# Altium schematic sheet protect circuit.SchDoc
size A4; SheetNumber: 2; SheetTotal: 2
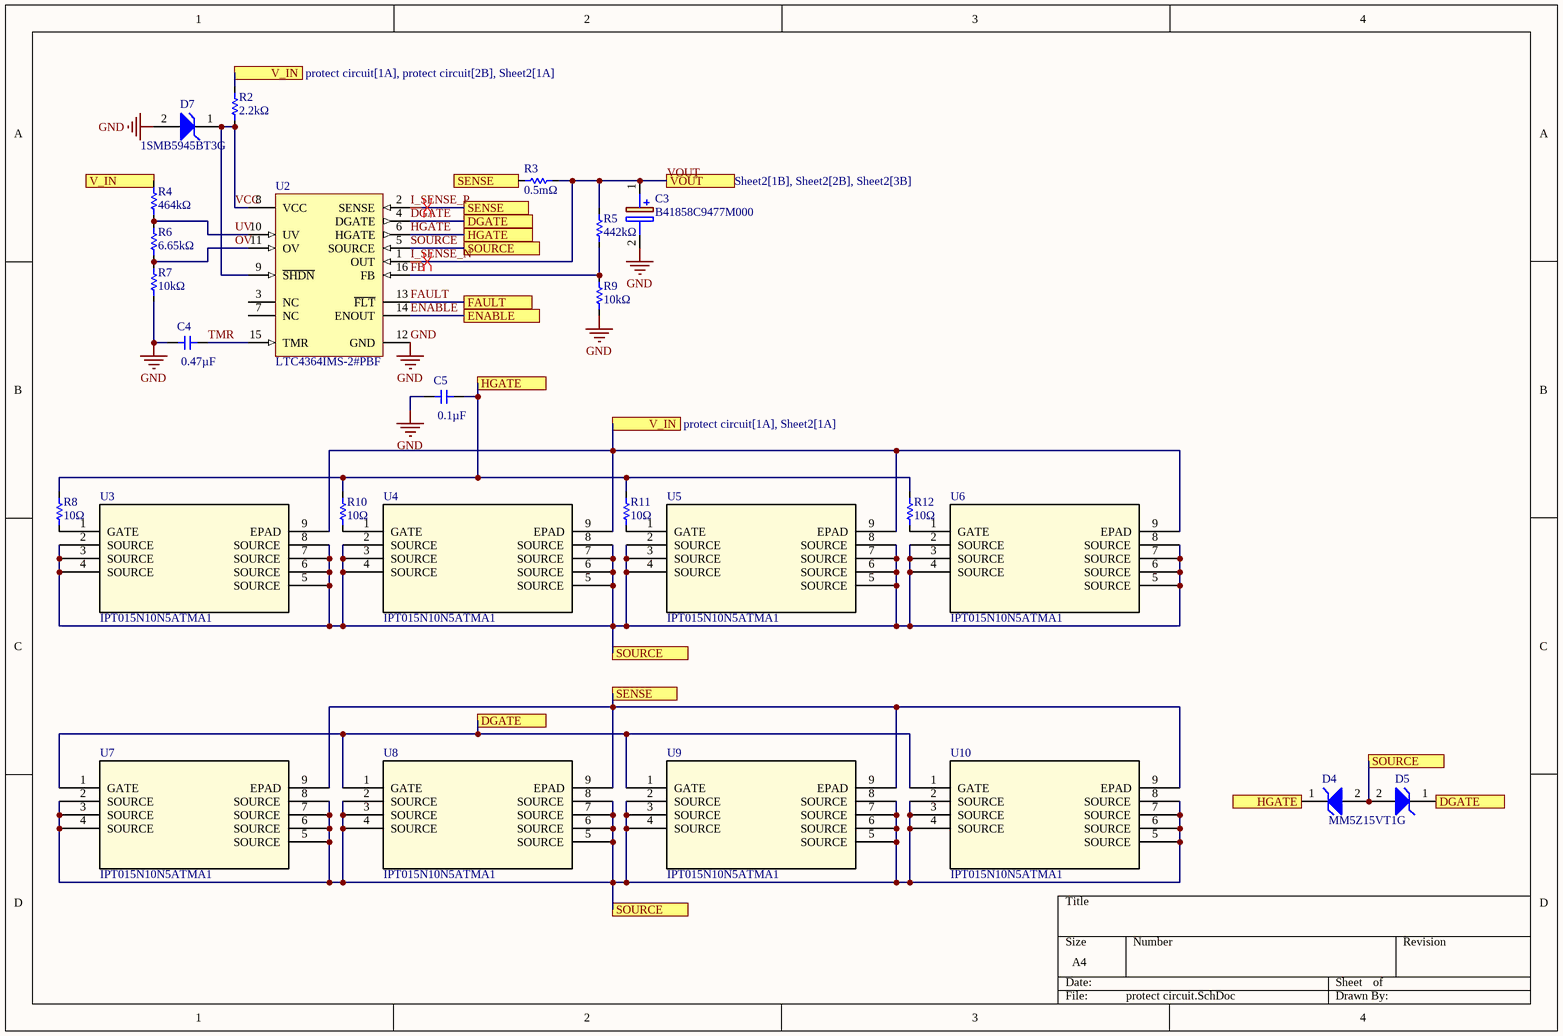
[diagram p0: protect circuit.SchDoc]

## Parts
C3  B41858C9477M000  [CAPPRD750W90D1800H3700]
C4  Capacitance: 0.47µF  [1210]  (hidden comment: non-polar_Capacitor)
C5  Capacitance: 0.1µF  [1210]  (hidden comment: non-polar_Capacitor)
D4  MM5Z15VT1G  [ONSC-SOD-523-2-502-01_V]
D5  MM5Z15VT1G  [ONSC-SOD-523-2-502-01_V]  (value not drawn)
D7  1SMB5945BT3G  [ONSC-SMB-2-403A-03_H_V]
R2  2.2kΩ  [SMD_2512]
R3  0.5mΩ  [SMD_2512]
R4  464kΩ  [SMD_0603]
R5  442kΩ  [SMD_0603]
R6  6.65kΩ  [SMD_0603]
R7  10kΩ  [SMD_0603]
R8  10Ω  [SMD_0603]
R9  10kΩ  [SMD_0603]
R10  10Ω  [SMD_0603]
R11  10Ω  [SMD_0603]
R12  10Ω  [SMD_0603]
U2  LTC4364IMS-2#PBF  [LT-MS-16_M]
U3  IPT015N10N5ATMA1  [PG-HSOF-8-1_INF]
U4  IPT015N10N5ATMA1  [PG-HSOF-8-1_INF]
U5  IPT015N10N5ATMA1  [PG-HSOF-8-1_INF]
U6  IPT015N10N5ATMA1  [PG-HSOF-8-1_INF]
U7  IPT015N10N5ATMA1  [PG-HSOF-8-1_INF]
U8  IPT015N10N5ATMA1  [PG-HSOF-8-1_INF]
U9  IPT015N10N5ATMA1  [PG-HSOF-8-1_INF]
U10  IPT015N10N5ATMA1  [PG-HSOF-8-1_INF]

## Ports
DGATE (see protect circuit[2A], protect circuit[2C]), DGATE (see protect circuit[2A], protect circuit[4D]), DGATE (see protect circuit[2C], protect circuit[4D]), ENABLE, FAULT, HGATE (see protect circuit[2A], protect circuit[2B]), HGATE (see protect circuit[2A], protect circuit[4D]), HGATE (see protect circuit[2B], protect circuit[4D]), SENSE (see protect circuit[2A]), SENSE (see protect circuit[2A], protect circuit[2C]), SOURCE (see protect circuit[2A], protect circuit[2C], protect circuit[2D]), SOURCE (see protect circuit[2A], protect circuit[2C], protect circuit[4C]), SOURCE (see protect circuit[2A], protect circuit[2D], protect circuit[4C]), SOURCE (see protect circuit[2C], protect circuit[2D], protect circuit[4C]), V_IN (see protect circuit[1A], protect circuit[2B], Sheet2[1A]), V_IN (see protect circuit[1A], Sheet2[1A]), VOUT (see Sheet2[1B], Sheet2[2B], Sheet2[3B])

## Nets
GND: C3.2(-) C4.1 C5.1 D7.2(A) R7.2 R9.2 U2.12(GND)
DGATE: D5.1(K) U2.4(DGATE) U7.1(GATE) U8.1(GATE) U9.1(GATE) U10.1(GATE) ; port DGATE
ENABLE: U2.14(ENOUT) ; port ENABLE
FAULT: U2.13(~{FLT}) ; port FAULT
FB: R5.2 R9.1 U2.16(FB)
HGATE: C5.2 D4.1(K) R8.1 R10.1 R11.1 R12.1 U2.6(HGATE) ; port HGATE
I_SENSE_N: C3.1(+) R3.2 R5.1 U2.1(OUT) ; port VOUT  [also labelled VOUT]
I_SENSE_P: R3.1 U2.2(SENSE) U7.9(EPAD) U8.9(EPAD) U9.9(EPAD) U10.9(EPAD) ; port SENSE
OV: R6.2 R7.1 U2.11(OV)
SOURCE: D4.2(A) D5.2(A) U2.5(SOURCE) U3.2(SOURCE) U3.3(SOURCE) U3.4(SOURCE) U3.5(SOURCE) U3.6(SOURCE) U3.7(SOURCE) U3.8(SOURCE) U4.2(SOURCE) U4.3(SOURCE) U4.4(SOURCE) U4.5(SOURCE) U4.6(SOURCE) U4.7(SOURCE) U4.8(SOURCE) U5.2(SOURCE) U5.3(SOURCE) U5.4(SOURCE) U5.5(SOURCE) U5.6(SOURCE) U5.7(SOURCE) U5.8(SOURCE) U6.2(SOURCE) U6.3(SOURCE) U6.4(SOURCE) U6.5(SOURCE) U6.6(SOURCE) U6.7(SOURCE) U6.8(SOURCE) U7.2(SOURCE) U7.3(SOURCE) U7.4(SOURCE) U7.5(SOURCE) U7.6(SOURCE) U7.7(SOURCE) U7.8(SOURCE) U8.2(SOURCE) U8.3(SOURCE) U8.4(SOURCE) U8.5(SOURCE) U8.6(SOURCE) U8.7(SOURCE) U8.8(SOURCE) U9.2(SOURCE) U9.3(SOURCE) U9.4(SOURCE) U9.5(SOURCE) U9.6(SOURCE) U9.7(SOURCE) U9.8(SOURCE) U10.2(SOURCE) U10.3(SOURCE) U10.4(SOURCE) U10.5(SOURCE) U10.6(SOURCE) U10.7(SOURCE) U10.8(SOURCE) ; port SOURCE
TMR: C4.2 U2.15(TMR)
UV: R4.2 R6.1 U2.10(UV)
V_IN: R2.1 R4.1 U3.9(EPAD) U4.9(EPAD) U5.9(EPAD) U6.9(EPAD) ; port V_IN
VCC: D7.1(K) R2.2 U2.8(VCC) U2.9(~{SHDN})
NetR8_2: R8.2 U3.1(GATE)
NetR10_2: R10.2 U4.1(GATE)
NetR11_2: R11.2 U5.1(GATE)
NetR12_2: R12.2 U6.1(GATE)

Not connected (* = marked no-connect by the designer): U2 3(NC) 7(NC)

## Layout directives
differential pair: I_SENSE_N, I_SENSE_P

## Library data of the parts
C3 = B41858C9477M000: Capacitor Polarised; Manufacturer_Name: TDK; Datasheet Link: https://product.tdk.com/system/files/dam/doc/product/capacitor/aluminum-electrolytic/single-ended/data_sheet/20/30/db/aec/b41858.pdf; Height: 37mm; Manufacturer_Part_Number: B41858C9477M000; Mouser Part Number: 871-B41858C9477M; Mouser Price/Stock: https://www.mouser.co.uk/ProductDetail/EPCOS-TDK/B41858C9477M000?qs=nadT%2FcWsIvCTpIhXZMST%2FQ%3D%3D
C4 C5 = CMP-024-000020-15: SMD type ceramic capacitor; Voltage: 50V; Design Item ID: Capacitor; Source: robit_passive.SchLib
D4 D5 = CMP-1060-00793-1: Zener Voltage Regulator, 500 mW, 2-Pin SOD-523, Pb-Free, Tape and Reel; Manufacturer: On Semiconductor; VZ Typ (V): 15; P Max (W): 0.5; PackageVersion: Rev. E, 09/2010; PartNumber: MM5Z15VT1G; ComponentLink2URL: http://www.onsemi.cn/pub_link/Collateral/MM5Z2V4T1-D.PDF; ComponentLink2Description: Datasheet; ComponentLink1Description: Manufacturer URL; PackageReference: SOD-523-2-502-01; ComponentLink3URL: http://www.onsemi.com/pub_link/Collateral/502-01.PDF; PackageDescription: 2-Pin SOD, Body 1.2 x 0.8 mm; ComponentLink3Description: Package Specification; RoHS: Pb-Free; ComponentLink1URL: http://www.onsemi.com/; Mounting Technology: Surface Mount; Packing: Tape and Reel; DatasheetVersion: Rev. 10
D7 = CMP-1060-00175-1: 3 W Zener Voltage Regulator, 2-Pin SMB, Pb-Free, Tape and Reel; Manufacturer: On Semiconductor; VZ Typ (V): 68; ComponentLink3URL: http://www.onsemi.com/pub_link/Collateral/1SMB5913BT3-D.PDF; PackageReference: SMB-2-403A-03_H; PackageDescription: 2-Pin Small Molded Package, J-Bend Lead, Body 4.33 x 3.625 mm; PackageVersion: Rev. H, 05/2011; PartNumber: 1SMB5945BT3G; DatasheetVersion: Rev. 8; ComponentLink1Description: Manufacturer URL; ComponentLink1URL: http://www.onsemi.com/; RoHS: Pb-Free; ComponentLink2Description: Datasheet; Packing: Tape and Reel; ComponentLink2URL: http://www.onsemi.com/pub_link/Collateral/1SMB5913BT3-D.PDF; ComponentLink3Description: Package Specification; Mounting Technology: Surface Mount
R2-R12 = Resistor
U2 = CMP-0474-00539-1: Surge Stopper with Ideal Diode, 4 to 80 V Vin, 16-pin SOP (MS-16), -40 to 85 degC, Pb-Free; Manufacturer: Linear Technology; Fast Comparator: no; Circuit Breaker Threshold: 50 mV; Circuit Breakers(#): 1; Active Limiting: yes; Vin Range: 4 to 80 V; Circuit Breaker Accuracy(%): 10; Extended Temp: C, I, H; ComponentLink1Description: Manufacturer URL; PackageReference: MS16; Mounting Technology: Surface Mount; RoHS: TRUE; PackageDescription: 16-Pin Plastic MSOP, Body 4.04 x 3.00 mm, Pitch 0.50 mm; ComponentLink3Description: Package Specification; PartNumber: LTC4364IMS-2#PBF; Power Good: no; ComponentLink2Description: Datasheet; ComponentLink2URL: http://cds.linear.com/docs/en/datasheet/436412f.pdf; ComponentLink1URL: http://www.linear.com/; ComponentLink3URL: http://cds.linear.com/docs/en/packaging/05081669_A_MS16.pdf; PackageVersion: Rev. Ã˜, 06/2010
U3-U10 = IPT015N10N5ATMA1: Infineonâ€™s OptiMOSâ„¢ power MOSFET in TO-Leadless package is optimized for high current applications up to 300 A, such as forklifts, light electric vehicles (LEV), power tools, point-of-loads (POL), telecom and e-fuses. Furthermore, the 60 percent smaller package size enables a very compact design. Compared to DÂ²PAK 7-pin, TO-Leadless shows a substantial reduction in footprint of 30 percent. The 50 percent reduced height offers a significant advantage in narrow applications such as rack or blade servers.; Copyright: Copyright (C) 2025 Ultra Librarian. All rights reserved.; Manufacturer_Name: Infineon; Manufacturer_Part_Number: IPT015N10N5ATMA1; RefDes: RefDes; Type: Type